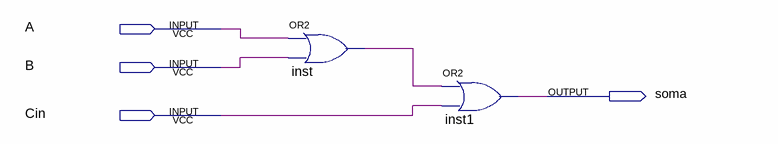
[diagram p0: schematic sheet]
// Quartus schematic somador_sem_carry.bdf as structural Verilog: 2 symbols, 4 pins
module somador_sem_carry (
  input  A,
  input  B,
  input  Cin,
  output soma
);

  wire inst_out;

  or inst (inst_out, A, B);
  or inst1 (soma, inst_out, Cin);
endmodule
